# EasyEDA schematic SCH_MedySync_2024-07-15.json
TITLE: MediSync PCB; REV: 1.0; Date: 2024-06-16; Sheet: 1/1; Company: FIT UOM
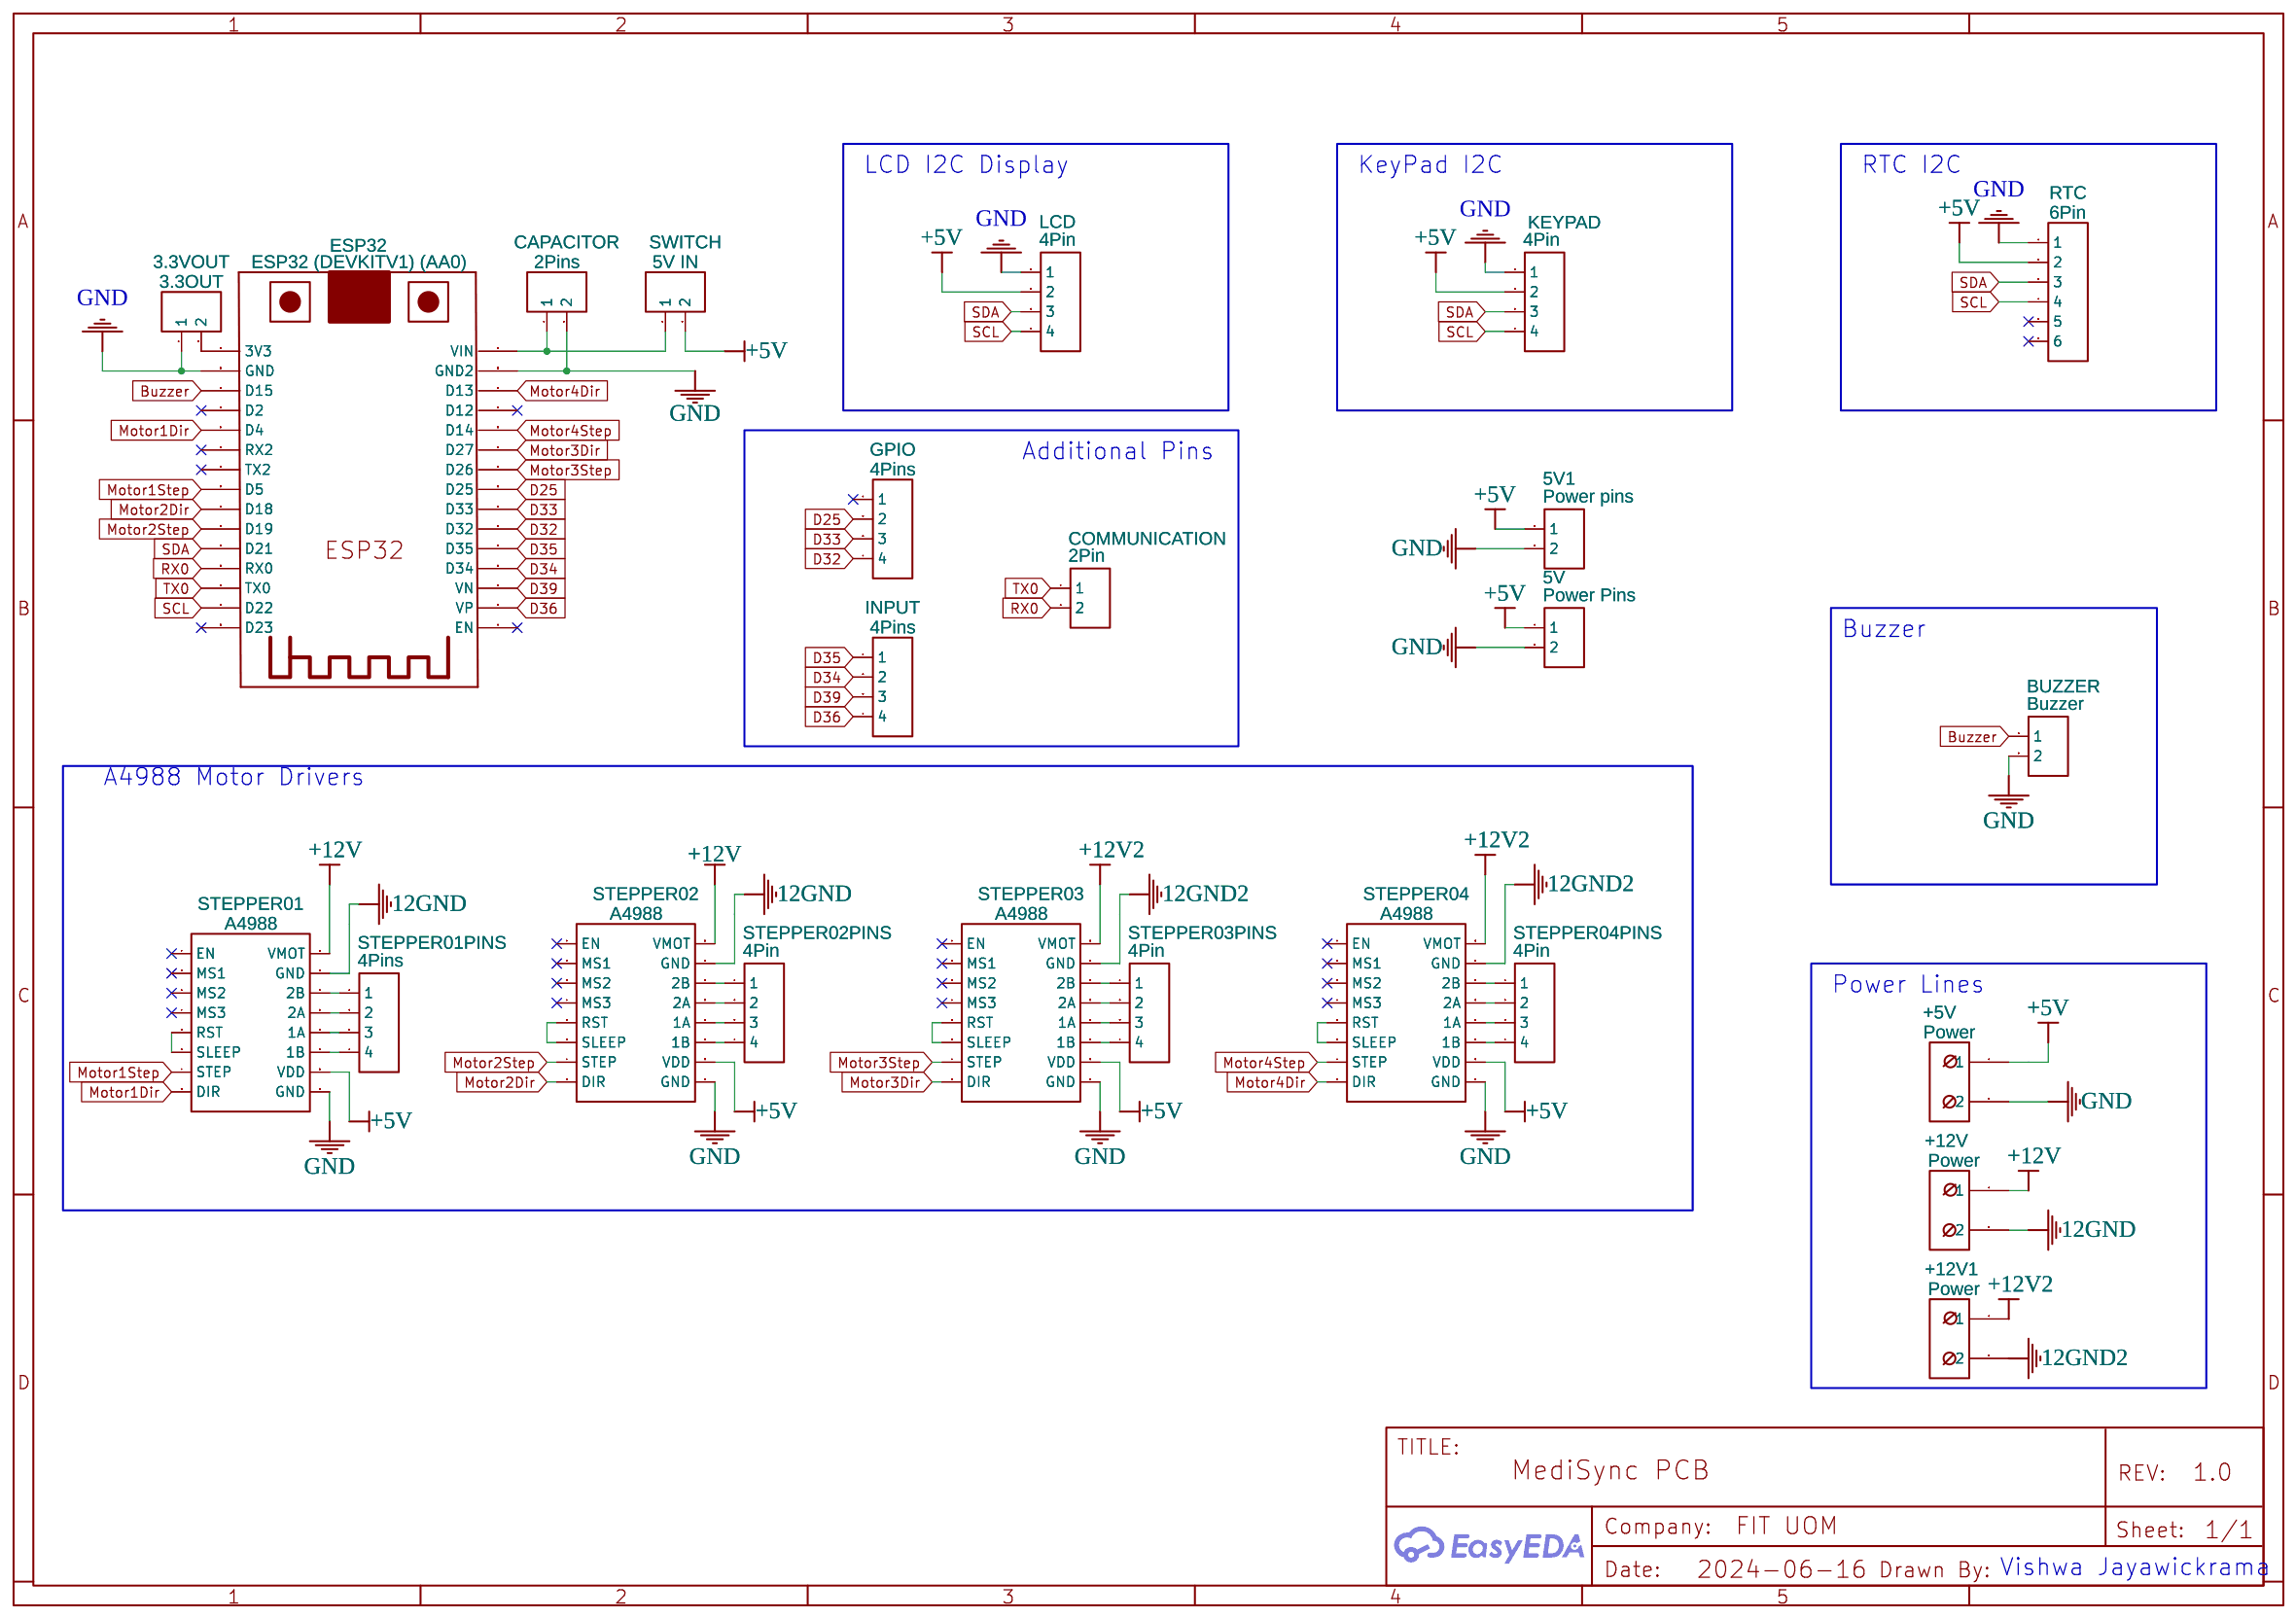
[diagram p0: schematic sheet]

## Parts
3.3VOUT  3.3OUT  [HDR-M-2.54_1X2]
5V  Power Pins  [HDR-M-2.54_1X2]
5V1  Power pins  [HDR-M-2.54_1X2]
+5V  Power  [5MM_2POS_TERMINAL_BLOCK_TPD]
+12V  Power  [5MM_2POS_TERMINAL_BLOCK_TPD]
+12V1  Power  [5MM_2POS_TERMINAL_BLOCK_TPD]
BUZZER  Buzzer  [HDR-M-2.54_1X2]
CAPACITOR  2Pins  [HDR-F-2.54_1X2]
COMMUNICATION  2Pin  [HDR-M-2.54_1X2]
ESP32  ESP32 (DEVKITV1) (AA0)  [ESP32-DEVKITV1_ESP32-DEVKITV1]
GPIO  4Pins  [HDR-M-2.54_1X4]
INPUT  4Pins  [HDR-M-2.54_1X4]
KEYPAD  4Pin  [HDR-M-2.54_1X4]
LCD  4Pin  [HDR-M-2.54_1X4]
RTC  6Pin  [HDR-F-2.54_1X6]
STEPPER01  A4988  [A4988]
STEPPER01PINS  4Pins  [HDR-M-2.54_1X4]
STEPPER02  A4988  [A4988]
STEPPER02PINS  4Pin  [HDR-M-2.54_1X4]
STEPPER03  A4988  [A4988]
STEPPER03PINS  4Pin  [HDR-M-2.54_1X4]
STEPPER04  A4988  [A4988]
STEPPER04PINS  4Pin  [HDR-M-2.54_1X4]
SWITCH  5V IN  [HDR-M-2.54_1X2]

## Library data of the parts
3.3VOUT 5V 5V1 BUZZER COMMUNICATION SWITCH = HDR-M-2.54_1x2: Supplier Part: C124375; Supplier: LCSC; Contributor: LCEDA_Lib
+5V +12V +12V1 = 2POSITION_TERMINAL_BLOCK: Contributor: tpdecker
CAPACITOR = HDR-F-2.54_1x2: Supplier Part: C49661; Supplier: LCSC; Contributor: LCEDA_Lib
ESP32 = ESP32-DEVKIT-V1-30PIN: Contributor: WahyuHidayanto
GPIO INPUT KEYPAD LCD STEPPER01PINS STEPPER02PINS STEPPER03PINS STEPPER04PINS = HDR-M-2.54_1x4: Supplier Part: C124378; Supplier: LCSC; Contributor: LCEDA_Lib
RTC = HDR-F-2.54_1x6: Supplier Part: C40877; Supplier: LCSC; Contributor: LCEDA_Lib
STEPPER01 STEPPER02 STEPPER03 STEPPER04 = A4988: Contributor: zxy123

## Nets
+5V: 5V.1 5V1.1 +5V.1 KEYPAD.2 LCD.2 RTC.2 STEPPER01.15(VDD) STEPPER02.15(VDD) STEPPER03.15(VDD) STEPPER04.15(VDD) SWITCH.2
+12V: +12V.1 STEPPER01.9(VMOT) STEPPER02.9(VMOT)
+12V2: +12V1.1 STEPPER03.9(VMOT) STEPPER04.9(VMOT)
GND: 3.3VOUT.1 5V.2 5V1.2 +5V.2 BUZZER.2 CAPACITOR.2 ESP32.GND ESP32.GND2 KEYPAD.1 LCD.1 RTC.1 STEPPER01.16(GND) STEPPER02.16(GND) STEPPER03.16(GND) STEPPER04.16(GND)
12GND: +12V.2 STEPPER01.10(GND) STEPPER02.10(GND)
12GND2: +12V1.2 STEPPER03.10(GND) STEPPER04.10(GND)
Buzzer: BUZZER.1 ESP32.D15
D25: ESP32.D25 GPIO.2
D32: ESP32.D32 GPIO.4
D33: ESP32.D33 GPIO.3
D34: ESP32.D34 INPUT.2
D35: ESP32.D35 INPUT.1
D36: ESP32.VP INPUT.4
D39: ESP32.VN INPUT.3
Motor1Dir: ESP32.D4 STEPPER01.8(DIR)
Motor1Step: ESP32.D5 STEPPER01.7(STEP)
Motor2Dir: ESP32.D18 STEPPER02.8(DIR)
Motor2Step: ESP32.D19 STEPPER02.7(STEP)
Motor3Dir: ESP32.D27 STEPPER03.8(DIR)
Motor3Step: ESP32.D26 STEPPER03.7(STEP)
Motor4Dir: ESP32.D13 STEPPER04.8(DIR)
Motor4Step: ESP32.D14 STEPPER04.7(STEP)
RX0: COMMUNICATION.2 ESP32.RX0
SCL: ESP32.D22 KEYPAD.4 LCD.4 RTC.4
SDA: ESP32.D21 KEYPAD.3 LCD.3 RTC.3
TX0: COMMUNICATION.1 ESP32.TX0
Net-(3.3VOUT-2): 3.3VOUT.2 ESP32.3V3
Net-(CAPACITOR-1): CAPACITOR.1 ESP32.VIN SWITCH.1
Net-(STEPPER01-5): STEPPER01.5(RST) STEPPER01.6(SLEEP)
Net-(STEPPER01-11): STEPPER01.11(2B) STEPPER01PINS.1
Net-(STEPPER01-12): STEPPER01.12(2A) STEPPER01PINS.2
Net-(STEPPER01-13): STEPPER01.13(1A) STEPPER01PINS.3
Net-(STEPPER01-14): STEPPER01.14(1B) STEPPER01PINS.4
Net-(STEPPER02-5): STEPPER02.5(RST) STEPPER02.6(SLEEP)
Net-(STEPPER02-11): STEPPER02.11(2B) STEPPER02PINS.1
Net-(STEPPER02-12): STEPPER02.12(2A) STEPPER02PINS.2
Net-(STEPPER02-13): STEPPER02.13(1A) STEPPER02PINS.3
Net-(STEPPER02-14): STEPPER02.14(1B) STEPPER02PINS.4
Net-(STEPPER03-5): STEPPER03.5(RST) STEPPER03.6(SLEEP)
Net-(STEPPER03-11): STEPPER03.11(2B) STEPPER03PINS.1
Net-(STEPPER03-12): STEPPER03.12(2A) STEPPER03PINS.2
Net-(STEPPER03-13): STEPPER03.13(1A) STEPPER03PINS.3
Net-(STEPPER03-14): STEPPER03.14(1B) STEPPER03PINS.4
Net-(STEPPER04-5): STEPPER04.5(RST) STEPPER04.6(SLEEP)
Net-(STEPPER04-11): STEPPER04.11(2B) STEPPER04PINS.1
Net-(STEPPER04-12): STEPPER04.12(2A) STEPPER04PINS.2
Net-(STEPPER04-13): STEPPER04.13(1A) STEPPER04PINS.3
Net-(STEPPER04-14): STEPPER04.14(1B) STEPPER04PINS.4

Not connected (* = marked no-connect by the designer): ESP32 D2* D12* D23* EN* RX2* TX2*; GPIO 1*; RTC 5* 6*; STEPPER01 1(EN)* 2(MS1)* 3(MS2)* 4(MS3)*; STEPPER02 1(EN)* 2(MS1)* 3(MS2)* 4(MS3)*; STEPPER03 1(EN)* 2(MS1)* 3(MS2)* 4(MS3)*; STEPPER04 1(EN)* 2(MS1)* 3(MS2)* 4(MS3)*

## Notes on the sheet
- LCD I2C Display
- KeyPad I2C
- RTC I2C
- Additional Pins
- Buzzer
- A4988 Motor Drivers
- Power Lines
- Vishwa Jayawickrama
